# Altium schematic sheet GPSModule.SchDoc: GPS Module
size A4; Revision: AA; SheetNumber: 2; SheetTotal: 4
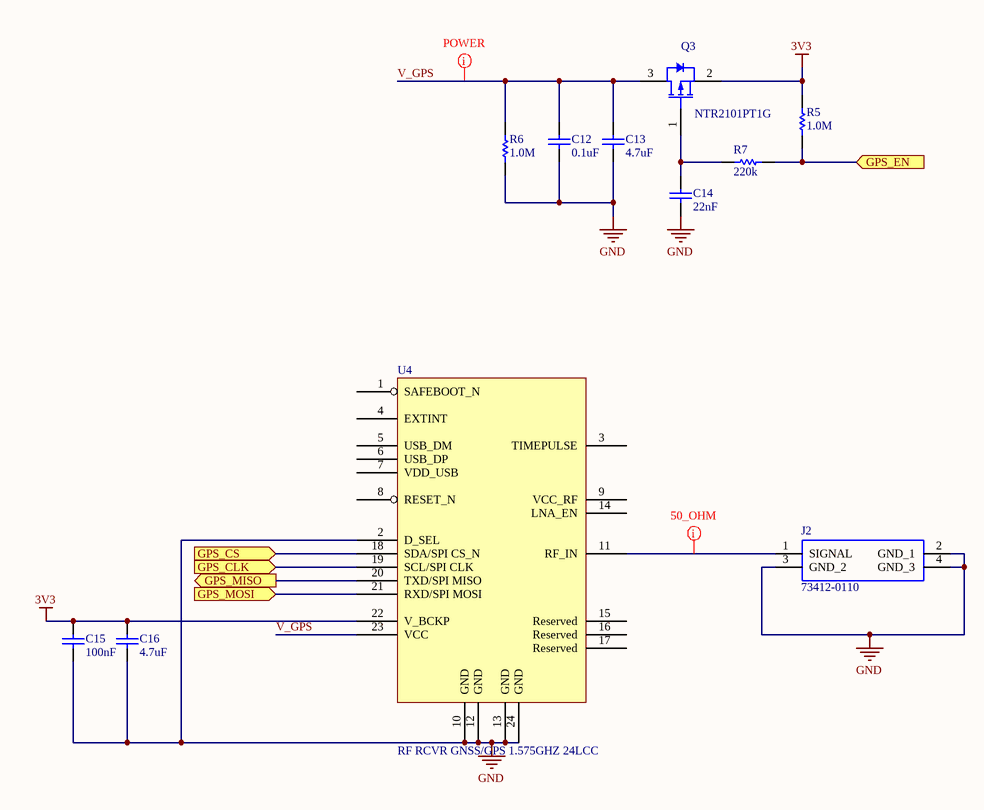
[diagram p0: GPSModule.SchDoc]

## Parts
C12  value 0.1uF  [0402cap]  (hidden comment: C0402)
C13  value 4.7uF  [0603CAP]  (hidden comment: C0603)
C14  value 22nF  [0402cap]  (hidden comment: C0402)
C15  value 100nF  [0402cap]  (hidden comment: C0402)
C16  value 4.7uF  [0603CAP]  (hidden comment: C0603)
J2  73412-0110  [73412-0110]
Q3  NTR2101PT1G  [ONSC-SOT-23-3-318-08_V]
R5  value 1.0M  [0402RES]  (hidden comment: R0402)
R6  value 1.0M  [0402RES]  (hidden comment: R0402)
R7  value 220k  [0402RES]  (hidden comment: R0402)
U4  RF RCVR GNSS/GPS 1.575GHZ 24LCC  [NEO-M8N-0]

## Ports
GPS_CLK (in), GPS_CS (in), GPS_EN (in), GPS_MISO (out), GPS_MOSI (in)

## Nets
3V3: C15.2 C16.2 Q3.2(S) R5.2 U4.22(V_BCKP)
GND: C12.1 C13.1 C14.1 C15.1 C16.1 J2.2(GND_1) J2.3(GND_2) J2.4(GND_3) R6.1 U4.2(D_SEL) U4.10(GND) U4.12(GND) U4.13(GND) U4.24(GND)
GPS_CLK: U4.19(SCL/SPI_CLK) ; port GPS_CLK
GPS_CS: U4.18(SDA/SPI_CS_N) ; port GPS_CS
GPS_EN: R5.1 R7.1 ; port GPS_EN
GPS_MISO: U4.20(TXD/SPI_MISO) ; port GPS_MISO
GPS_MOSI: U4.21(RXD/SPI_MOSI) ; port GPS_MOSI
V_GPS: C12.2 C13.2 Q3.3(D) R6.2 U4.23(VCC)
NetC14_2: C14.2 Q3.1(G) R7.2
NetJ2_1: J2.1(SIGNAL) U4.11(RF_IN)

Not connected (* = marked no-connect by the designer): U4 1(SAFEBOOT_N) 3(TIMEPULSE) 4(EXTINT) 5(USB_DM) 6(USB_DP) 7(VDD_USB) 8(RESET_N) 9(VCC_RF) 14(LNA_EN) 15(Reserved) 16(Reserved) 17(Reserved)

## Layout directives
net class POWER: V_GPS
net class 50 OHM: NetJ2_1

## Notes on the sheet
- Title
- Size:
- Date:
- A4
- Number:
- Time:
- Revision:
- Sheet
- of
- Grand Valley State University
- 301 W Fulton St
- Grand Rapids, MI
- 49504
- File:

## Library data of the parts
C12 C14 C15 = C0402: 0402 Ceramic Chip Capacitor - Standard
C13 C16 = C0603: 0603 Ceramic Chip Capacitor - Standard
J2 = 73412-0110: 50 Ohms, MCRF, PCB Vertical Jack Receptacle, SMT, 1.25mm Mounted Height; Manufacturer 1: Molex; Allied_Number: 70357960; Manufacturer Part Number 1: 73412-0110; RS Part Number: 1676350; RS Price/Stock: http://uk.rs-online.com/web/p/products/1676350; Allied Price/Stock: https://www.alliedelec.com/molex-incorporated-73412-0110/70357960/; Mouser Part Number: 538-73412-0110; Mouser Price/Stock: https://www.mouser.com/Search/Refine.aspx?Keyword=538-73412-0110; Datasheet Link: http://www.molex.com/pdm_docs/sd/734120110_sd.pdf; Supplier 1: Digi-Key; Supplier Part Number 1: WM5587CT-ND
Q3 = NTR2101PT1G: Small Signal MOSFET, -8 V, -3.7 A, Single P-Channel, 3-Pin SOT-23, Pb-Free, Tape and Reel; Manufacturer 1: On Semiconductor; Channel Polarity: P Channel; Ciss Typ (pF): 1173; Coss Typ (pF): 289; Crss Typ (pF): 218; ID Max (A): 3.7; PD Max (W): 0.96; V(BR)DSS Min (V): 8; VGS(th) Max (V): 1; DatasheetVersion: Rev. 6; PackageVersion: Rev. AP, 11/2009; PackageReference: SOT-23-3-318-08; PackageDescription: 3-Pin Small Outline Transistor, Body 2.92 x 1.3 mm, Pitch 0.95 mm; Configuration: Single; Package Type: SOT-23-3; Packing: Tape and Reel; RoHS: Pb-Free; VGS Max (V): 8; Mounting Technology: Surface Mount; Manufacturer Part Number 1: NTR2101PT1G; ComponentLink1Description: Manufacturer URL; ComponentLink1URL: http://www.onsemi.com/; ComponentLink2Description: Datasheet; ComponentLink2URL: http://www.onsemi.cn/pub_link/Collateral/NTR2101P-D.PDF; ComponentLink3Description: Package Specification; ComponentLink3URL: http://www.onsemi.cn/pub_link/Collateral/318-08.PDF
R5-R7 = R0402: 0402 Chip Resistor - Standard; ComponentLink1URL: *
U4 = NEO-M8N-0: Concurrent GNSS LCC module, TCXO, Flash, SAW, LNA; Manufacturer 1: U-Blox America Inc.; Manufacturer Part Number 1: NEO-M8N-0; Supplier 1: Digi-Key; Supplier Part Number 1: 672-1008-1-ND